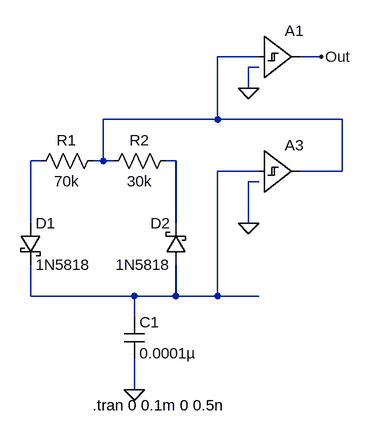
[diagram p0: schematic Diode pwm.asc]
Diode pwm.asc, the LTspice schematic file:
Version 4
SHEET 1 880 680
WIRE 208 -272 144 -272
WIRE 304 -272 272 -272
WIRE 208 -256 192 -256
WIRE 192 -224 192 -256
WIRE 144 -176 144 -272
WIRE 144 -176 -32 -176
WIRE 336 -176 144 -176
WIRE -128 -112 -144 -112
WIRE -32 -112 -32 -176
WIRE -32 -112 -48 -112
WIRE -16 -112 -32 -112
WIRE 80 -112 64 -112
WIRE 208 -96 144 -96
WIRE 336 -96 336 -176
WIRE 336 -96 272 -96
WIRE 208 -80 192 -80
WIRE -144 -16 -144 -112
WIRE 80 -16 80 -112
WIRE 192 -16 192 -80
WIRE -144 96 -144 48
WIRE 16 96 -144 96
WIRE 80 96 80 48
WIRE 80 96 16 96
WIRE 144 96 144 -96
WIRE 144 96 80 96
WIRE 208 96 144 96
WIRE 16 128 16 96
WIRE 16 240 16 192
FLAG 16 240 0
FLAG 304 -272 Out
FLAG 192 -16 0
FLAG 192 -224 0
SYMBOL schottky -160 -16 R0
SYMATTR InstName D1
SYMATTR Value 1N5818
SYMATTR Description Diode
SYMATTR Type diode
SYMBOL schottky 96 48 R180
WINDOW 0 24 64 Left 2
WINDOW 3 24 0 Left 2
SYMATTR InstName D2
SYMATTR Value 1N5818
SYMATTR Description Diode
SYMATTR Type diode
SYMBOL cap 0 128 R0
SYMATTR InstName C1
SYMATTR Value 0.0001µ
SYMATTR SpiceLine V=10 Irms=8.5 Rser=0.0114292 Lser=0 mfg="KEMET" pn="C0402C105K8PAC" type="X5R"
SYMBOL res -32 -128 R90
WINDOW 0 0 56 VBottom 2
WINDOW 3 32 56 VTop 2
SYMATTR InstName R1
SYMATTR Value 70k
SYMBOL res 80 -128 R90
WINDOW 0 0 56 VBottom 2
WINDOW 3 32 56 VTop 2
SYMATTR InstName R2
SYMATTR Value 30k
SYMBOL Digital\\schmtbuf 208 -160 R0
SYMATTR InstName A3
SYMBOL Digital\\schmtbuf 208 -336 R0
SYMATTR InstName A1
TEXT -48 264 Left 2 !.tran 0 0.1m 0 0.5n

The netlist it stands for:
* Diode pwm.asc
D1 N002 N004 1N5818
D2 N004 N003 1N5818
C1 N004 0 0.0001µ V=10 Irms=8.5 Rser=0.0114292 Lser=0 mfg="KEMET" pn="C0402C105K8PAC" type="X5R"
R1 N001 N002 70k
R2 N003 N001 30k
A3 N004 0 0 0 0 0 N001 0 SCHMITT
A1 N001 0 0 0 0 0 Out 0 SCHMITT
.model D D
.lib standard.dio
.tran 0 0.1m 0 0.5n
.backanno
.end